# Altium schematic sheet main.SchDoc: Smartphone OHIS interface
size A4; Engineer: CT; SheetNumber: 1; SheetTotal: 1
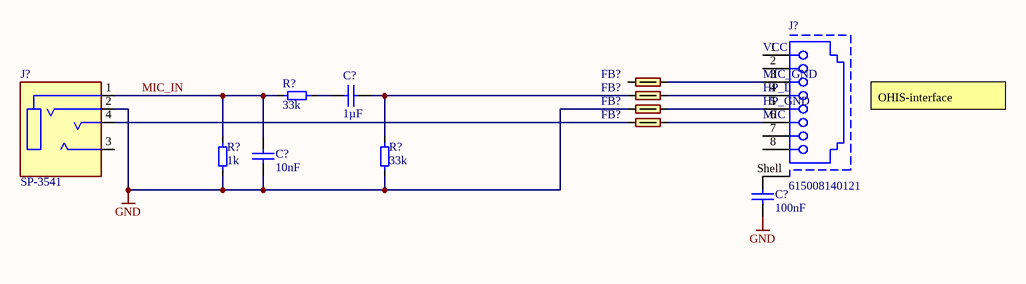
[diagram p0: main.SchDoc]

## Parts
(Parts that share a designator on the sheet are numbered #1, #2 ... from top to bottom, then left to right.)
C?#1  value 1µF  [0603-C-L]  (hidden comment: Capacitor 1uF +/-10% 10V X5R 0603)
C?#2  value 10nF  [0603-C-L]  (hidden comment: Capacitor 10nF +/-10% 50V X7R 0603)
C?#3  value 100nF  [0603-C-N]  (hidden comment: Capacitor 100nF +/-10% 50V X7R 0603)
FB?#1  742861210  [0603-FB-N]  (value not drawn)
FB?#2  742861210  [0603-FB-N]  (value not drawn)
FB?#3  742861210  [0603-FB-N]  (value not drawn)
FB?#4  742861210  [0603-FB-N]  (value not drawn)
J?#1  615008140121  [615008140121]
J?#2  SP-3541  [SP-3541-Footprint-1]
R?#1  value 33k  [0603-R-N]  (hidden comment: Resistor 33k +/-1% 50V 0603)
R?#2  value 1k  [0603-R-N]  (hidden comment: Resistor 1k +/-1% 50V 0603)
R?#3  value 33k  [0603-R-N]  (hidden comment: Resistor 33k +/-1% 50V 0603)

## Nets
GND: C?#2.1 C?#3.1 FB?#3.2 J?#2.2 R?#2.1 R?#3.1
MIC_IN: C?#2.2 J?#2.1 R?#1.1 R?#2.2
NetC?#1_1: C?#1.1 R?#1.2
NetC?#1_2: C?#1.2 FB?#2.2 R?#3.2
NetC?#3_2: C?#3.2 J?#1.Shell
NetFB?#1_1: FB?#1.1 J?#1.3
NetFB?#2_1: FB?#2.1 J?#1.4
NetFB?#3_1: FB?#3.1 J?#1.5
NetFB?#4_1: FB?#4.1 J?#1.6
NetFB?#4_2: FB?#4.2 J?#2.4

Not connected (* = marked no-connect by the designer): FB?#1 2; J?#1 1 2 7 8; J?#2 3

## Notes on the sheet
- (near J?#1) VCC
- (near J?#1) MIC_GND
- (near J?#1) HP_L
- (near J?#1) HP_GND
- (near J?#1) MIC
- OHIS-interface
- Title
- Sheet Revision:
- Link:
- Size:
- Project:
- Engineer:
- A4
- Date:
- Sheet
- of
- File:

## Library data of the parts
C?#1 = CMP-001-00115-12: Capacitor MLCC, General Purpose, size 0603, X5R, 1uF, +/-10%, 10V; Tolerance: 10%; JLCPCB Part #: C15849; Min Operating Temperature: -55°C; Dielectric: X5R; Case/Package: 0603; Mounting Technology: SMT; RoHS Compliant: Yes; Usage: General Purpose; Length: 1.6mm; Max Operating Temperature: 85°C; Capacitor Type: MLCC; Width: 0.8mm; Pins: 2; Voltage Rating: 10V; Height: 0.8mm
C?#2 = CMP-001-00089-15: Capacitor MLCC, General Purpose, size 0603, X7R, 10nF, +/-10%, 50V; Tolerance: 10%; Voltage Rating: 50V; RoHS Compliant: True; Mounting Technology: SMT; Max Operating Temperature: 125°C; Length: 1.6mm; Capacitor Type: MLCC; Case/Package: 0603; JLCPCB Part #: C57112; Min Operating Temperature: -55°C; Usage: General Purpose; Packaging: Cut Tape; Width: 0.8mm; REACH SVHC: No SVHC; Height: 0.8mm; Dielectric: X7R; Pins: 2
C?#3 = CMP-001-00017-20: Capacitor MLCC, General Purpose, size 0603, X7R, 100nF, +/-10%, 50V; Tolerance: 10%; RoHS Compliant: True; Capacitor Type: MLCC; Width: 0.8mm; Max Operating Temperature: 125°C; Min Operating Temperature: -55°C; Case/Package: 0603; Usage: General Purpose; Length: 1.6mm; Pins: 2; Voltage Rating: 50V; Height: 0.8mm; Dielectric: X7R; JLCPCB Part #: C14663; Mounting Technology: SMT
FB?#1-FB?#4 = CMP-006-00040-1: Ferrite Beads Multi-Layer 1KOhm 25% 100MHz 50mA 1.8Ohm DCR 0603 T/R; Number of Lines: 1; Value: 1.8R; Impedance: 1kR; Width: 0.8mm; Length: 1.6mm; Height: 0.8mm; Packaging: Tape and Reel; Core Material: Ferrite; Reach SVHC Compliant: Unknown; Mounting Technology: Surface Mount; Tolerance: 25%; Case Code (Metric): 1608; RoHS Compliant: Yes; Case/Package: SMD/SMT; Pins: 2; Max DC Current: 50mA; Case Code (Imperial): 0603; Series: WE-CBF HF; Package Quantity: 1; Depth: 0.8mm; Test Frequency: 100MHz; Min Operating Temperature: -55°C; Max Current Rating: 50mA; Max Operating Temperature: 125°C; Termination: SMD/SMT
J?#1 = CMP-059-000021-2: WR-MJ Modular Jack THT Horizontal Shielded Front Grounding Post 8P8C Tab Down; pin to pad: Shell>S1+S2; Manufacturer: Wurth Elektronik; Contact Resistance: 20mOhm; Rated Current: 1.5A; Shielding: Yes; Withstanding Voltage: 1000VAC; LED: No; Number of Ports: 1; Insulation Resistance: 500MOhm; Working Voltage: 120VAC; Manufacturer Part Number: 615008140121; Pin Count: 9; ComponentLink1URL: https://www.we-online.com/redexpert/article/615008140121?ad; Number of Pins: 8P8C; Category: Input/Output Connectors; Design Item ID: 615008140121; Mount: Through Hole; JLCPCB Part #: C3010555; Component Type: Standard; Operating Temperature Min: -40°C; Operating Temperature Max: 85°C; Orientation: Horizontal; Source: WR-MJ.SchLib; ComponentLink1Description: Manufacturer Link; ComponentLink2URL: https://www.we-online.com/redexpert/spec/615008140121?ad; Match Code: WR-MJ; ComponentLink2Description: Datasheet; Packaging: Tray
J?#2 = CMP-002-00131-1: 3.5 mm, Stereo, PCB Mount, Through Hole, Audio Plug Connector; Gender: Male; Current Rating: 1A; Body Material: Brass; Body Color: Black; Shielding: Unshielded; Packaging: Bulk; Termination: Solder; Housing Material: Nylon; Series: -; RoHS Compliant: Yes; Min Operating Temperature: -25°C; Connector Type: Plug; Insulation Color: Black; Mounting Technology: Through Hole; Contact Material: Brass; Max Operating Temperature: 70°C; Contact Plating: Nickel
R?#1 R?#3 = CMP-009-00214-15: Chip Resistor, Thick Film, General Purpose, 0603, 100mW, 50V, 33 kOhm, +/-1%; Elements: 1; Tolerance: 1%; Mounting Technology: SMT; Power Rating: 100mW; JLCPCB Part #: C4216; Pins: 2; Case/Package: 0603; RoHS Compliant: Yes; Resistor Type: Thick Film; Min Operating Temperature: -55°C; Max Operating Temperature: 155°C; Usage: General Purpose; Voltage Rating: 50V
R?#2 = CMP-009-00014-25: Chip Resistor, Thick Film, General Purpose, 0603, 100mW, 50V, 1 kOhm, +/-1%; Elements: 1; Tolerance: 1%; Max Operating Temperature: 155°C; JLCPCB Part #: C21190; Mounting Technology: SMT; Power Rating: 100mW; Usage: General Purpose; Case/Package: 0603; Pins: 2; Voltage Rating: 50V; RoHS Compliant: Yes; Resistor Type: Thick Film; Min Operating Temperature: -55°C